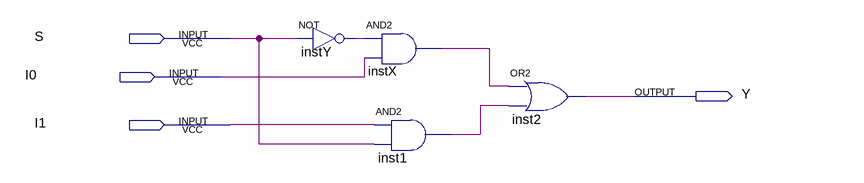
[diagram p0: schematic sheet]
// Quartus schematic MUX2_1.bdf as structural Verilog: 4 symbols, 4 pins
module MUX2_1 (
  input  S,
  input  I0,
  input  I1,
  output Y
);

  wire inst1_out, instX_out, instY_out;

  not instY (instY_out, S);
  and instX (instX_out, instY_out, I0);
  and inst1 (inst1_out, I1, S);
  or inst2 (Y, instX_out, inst1_out);
endmodule
